# Altium schematic sheet payload_esp32.SchDoc (part 4 of 4)
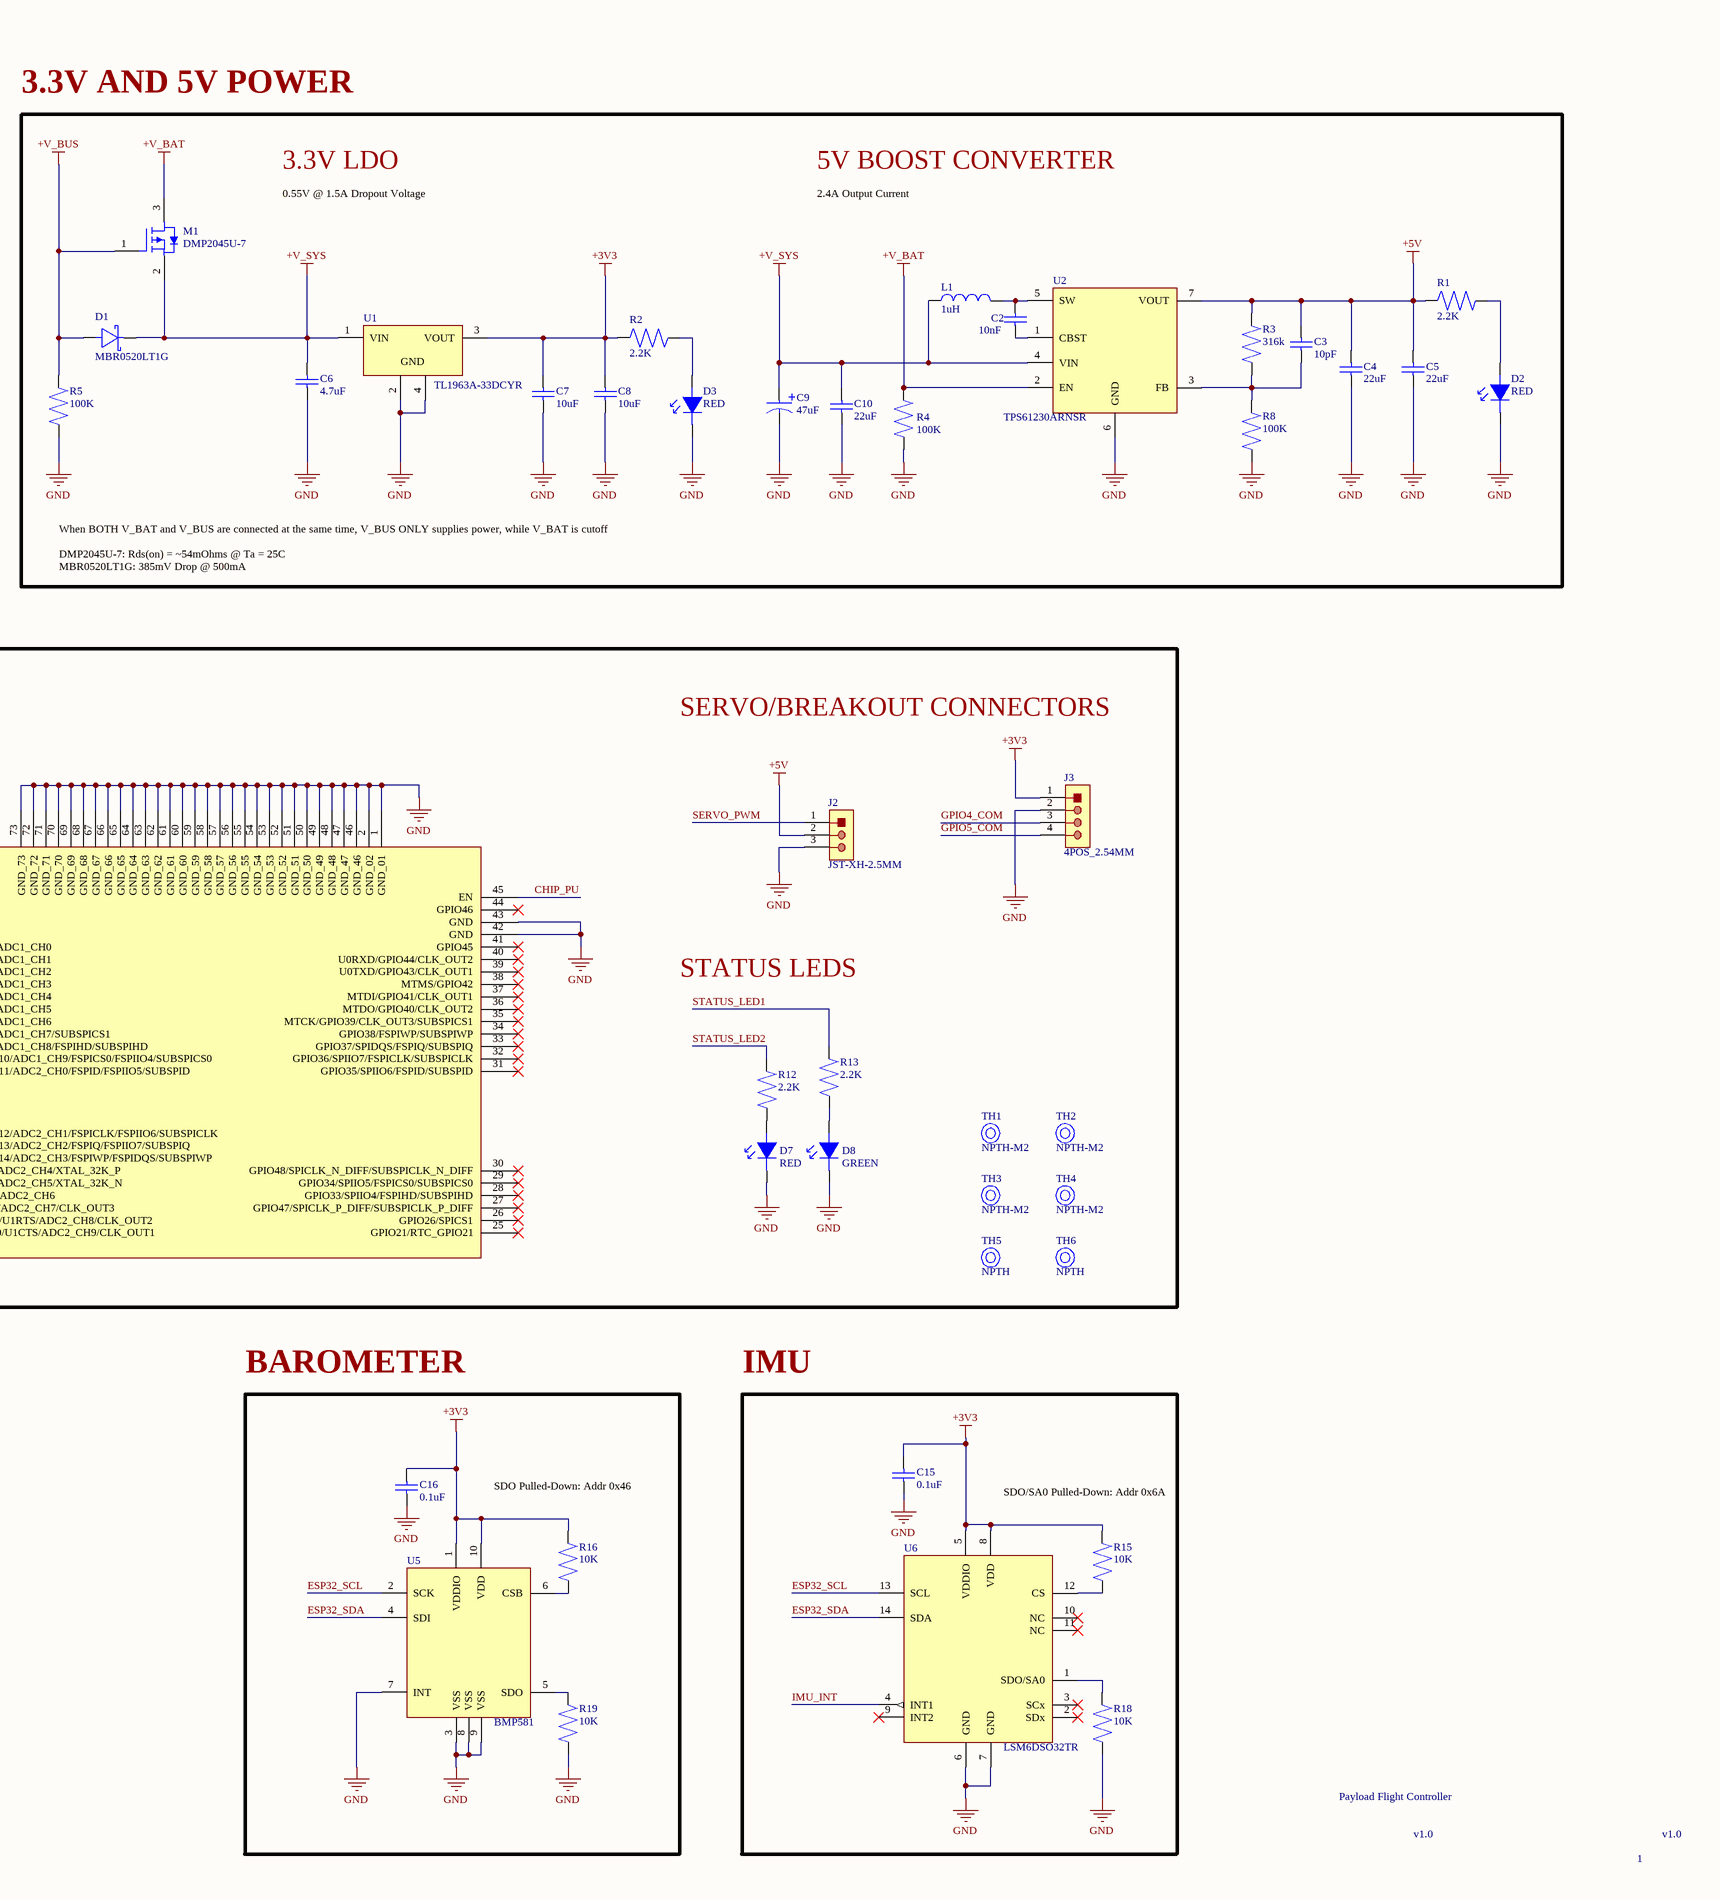
[diagram p4: payload_esp32.SchDoc, right]

## Library data of the parts (continued)
R14 = RC0402FR-07330RL: RES 330 OHM 1% 1/16W 0402; Manufacturer: Yageo Group; Max Power Dissipation: 63mW; Power Dissipation: 62.5mW; Value: 330Ω; Temperature Coefficient: 100ppm/°C; Voltage Rating: 50V; Supplier: DigiKey; Supplier Part Number: 311-330LRCT-ND; Manufacturer Part Number: RC0402FR-07330RL; RoHS: Compliant; Category: Chip SMD Resistors; Stock: 859594; Pricing: 1=0.1, 10=0.004, 25=0.0032, 10000=0.00127 (USD); Case/Package: 0402; Case Code (Imperial): 0402; China RoHS: Non-Compliant; Composition: Thick Film; Country of Origin: Mainland China, Taiwan; Depth: 500µm; Export Control Classification Number (ECCN) Code: EAR99; Features: Moisture Resistant; Height: 350µm; Harmonized Tariff Schedule (HTS) Code: 8533.21.00.30; Introduction Date: 2008-07-18; Lead Free: Lead Free; Length: 1mm; Lifecycle Status: Production; Max Operating Temperature: 155°C; Military Standard: Not; Min Operating Temperature: -55°C; Mounting Technology: Surface Mount; Pins: 2; Number of Terminals: 2; Number of Terminations: 2; Packaging: Tape & Reel; Power Rating: 63mW; REACH SVHC: Yes; Schedule B: 8533210045, 8533210045|8533210045|8533210045|8533210045|8533210045|8533210045|8533210045|8533210045|8533210045|8533210045|8533210045|8533210045|8533210045|8533210045|8533210045|8533210045|8533210045|8533210045|8533210045|8533210045|8533210045, 8533210045|8533210045|8533210045|8533210045|8533210045|8533210045|8533210045|8533210045|8533210045|8533210045|8533210045|8533210045|8533210045|8533210045|8533210045|8533210045|8533210045|8533210045|8533210045|8533210045|8533210045|8533210045, 8533210045|8533210045|8533210045|8533210045|8533210045|8533210045|8533210045|8533210045|8533210045|8533210045|8533210045|8533210045|8533210045|8533210045|8533210045|8533210045|8533210045|8533210045|8533210045|8533210045|8533210045|8533210045|8533210045; Termination: SMD/SMT; Tolerance: 1%; Voltage Rating (AC): 50V; Voltage Rating (DC): 50V; Width: 500µm; Working Voltage: 50V; ComponentLink1URL: https://datasheet.octopart.com:443/RC0402FR-07330RL-Yageo-datasheet-175887523.pdf?src-supplier=IHS; ComponentLink1Description: https://datasheet.octopart.com:443/RC0402FR-07330RL-Yageo-datasheet-175887523.pdf?src-supplier=IHS; ComponentLink2URL: https://datasheet.octopart.com:443/RC0402FR-07330RL-Yageo-datasheet-103092701.pdf?src-supplier=Upverter; ComponentLink2Description: https://datasheet.octopart.com:443/RC0402FR-07330RL-Yageo-datasheet-103092701.pdf?src-supplier=Upverter; ComponentLink3URL: https://datasheet.octopart.com:443/RC0402FR-07330RL-Yageo-datasheet-10408619.pdf?src-supplier=element14+APAC; ComponentLink3Description: https://datasheet.octopart.com:443/RC0402FR-07330RL-Yageo-datasheet-10408619.pdf?src-supplier=element14+APAC; ComponentLink4URL: https://datasheet.octopart.com:443/RC0402FR-07330RL-Yageo-datasheet-8324527.pdf?src-supplier=Newark; ComponentLink4Description: https://datasheet.octopart.com:443/RC0402FR-07330RL-Yageo-datasheet-8324527.pdf?src-supplier=Newark; ComponentLink5URL: https://datasheet.octopart.com:443/RC0402FR-07330RL-Yageo-datasheet-62067350.pdf?src-supplier=Farnell; ComponentLink5Description: https://datasheet.octopart.com:443/RC0402FR-07330RL-Yageo-datasheet-62067350.pdf?src-supplier=Farnell; ComponentLink6URL: https://datasheet.octopart.com:443/RC0402FR-07330RL-Yageo-Group-datasheet-176638170.pdf?src-supplier=Future+Electronics; ComponentLink6Description: https://datasheet.octopart.com:443/RC0402FR-07330RL-Yageo-Group-datasheet-176638170.pdf?src-supplier=Future+Electronics; ComponentLink7URL: https://datasheet.octopart.com:443/RC0402FR-07330RL-Yageo-datasheet-164759695.pdf?src-supplier=Future+Electronics; ComponentLink7Description: https://datasheet.octopart.com:443/RC0402FR-07330RL-Yageo-datasheet-164759695.pdf?src-supplier=Future+Electronics; ComponentLink8URL: https://datasheet.octopart.com:443/RC0402FR-07330RL-Yageo-datasheet-137700087.pdf?src-supplier=Future+Electronics; ComponentLink8Description: https://datasheet.octopart.com:443/RC0402FR-07330RL-Yageo-datasheet-137700087.pdf?src-supplier=Future+Electronics; ComponentLink9URL: https://datasheet.octopart.com:443/RC0402FR-07330RL-Yageo-datasheet-12531192.pdf?src-supplier=Future+Electronics; ComponentLink9Description: https://datasheet.octopart.com:443/RC0402FR-07330RL-Yageo-datasheet-12531192.pdf?src-supplier=Future+Electronics; ComponentLink10URL: https://datasheet.octopart.com:443/RC0402FR-07330RL-Yageo-datasheet-8324255.pdf?src-supplier=Future+Electronics; ComponentLink10Description: https://datasheet.octopart.com:443/RC0402FR-07330RL-Yageo-datasheet-8324255.pdf?src-supplier=Future+Electronics; ComponentLink11URL: https://datasheet.octopart.com:443/RC0402FR-07330RL-Yageo-datasheet-148775077.pdf?src-supplier=TME; ComponentLink11Description: https://datasheet.octopart.com:443/RC0402FR-07330RL-Yageo-datasheet-148775077.pdf?src-supplier=TME; ComponentLink12URL: https://datasheet.octopart.com:443/RC0402FR-07330RL-Yageo-datasheet-79472498.pdf?src-supplier=Megastar; ComponentLink12Description: https://datasheet.octopart.com:443/RC0402FR-07330RL-Yageo-datasheet-79472498.pdf?src-supplier=Megastar; ComponentLink13URL: https://datasheet.octopart.com/RC0402FR-07330RL-Yageo-datasheet-73766026.pdf; ComponentLink13Description: https://datasheet.octopart.com/RC0402FR-07330RL-Yageo-datasheet-73766026.pdf; ComponentLink14URL: https://datasheet.octopart.com:443/RC0402FR-07330RL-Yageo-datasheet-8329306.pdf?src-supplier=element14; ComponentLink14Description: https://datasheet.octopart.com:443/RC0402FR-07330RL-Yageo-datasheet-8329306.pdf?src-supplier=element14; ComponentLink15URL: http://sigma.octopart.com:80/conflict_mineral_statement/Yageo-company-3.pdf?src-supplier=Compliance+Statements; ComponentLink15Description: http://sigma.octopart.com:80/conflict_mineral_statement/Yageo-company-3.pdf?src-supplier=Compliance+Statements; ComponentLink16URL: http://sigma.octopart.com:80/rohs_statement/Yageo-company-2.pdf?src-supplier=Compliance+Statements; ComponentLink16Description: http://sigma.octopart.com:80/rohs_statement/Yageo-company-2.pdf?src-supplier=Compliance+Statements
R20 = WSLP1206R0120FEA: RES 0.012 OHM 1% 1W 1206; Manufacturer: Vishay; Value: 12mΩ; Temperature Coefficient: 75ppm/°C; Working Voltage: 109.5mV; Supplier: DigiKey; Supplier Part Number: 541-10353-1-ND; Manufacturer Part Number: WSLP1206R0120FEA; RoHS: Compliant; Category: Chip SMD Resistors; Stock: 7509; Pricing: 1=1.11, 10=0.723, 25=0.6188, 50=0.5532, 100=0.4976, 250=0.43656, 500=0.39838, 1000=0.36593 (USD); Case/Package: 1206; Case Code (Imperial): 1206; Case Code (Metric): 3216; China RoHS: Compliant; Composition: Metal Strip; Contact Plating: Tin; Country of Origin: Israel, Mexico, USA; Export Control Classification Number (ECCN) Code: EAR99; Height: 635µm; Harmonized Tariff Schedule (HTS) Code: 8533.21.00.30; Introduction Date: 2010-12-10; Length: 3.2mm; Lifecycle Status: Production; Max Operating Temperature: 170°C; Min Operating Temperature: -65°C; Mounting Technology: Surface Mount; Number of Terminals: 2; Power Dissipation: 1W; Power Rating: 1W; Radiation Hardening: No; Ratings: AEC-Q200; REACH SVHC: Yes; Termination: SMD/SMT; Tolerance: 1%; Weight: 16.187578mg; Width: 1.6mm; ComponentLink1URL: https://datasheet.octopart.com:443/WSLP1206R0120FEA-Vishay-datasheet-181963776.pdf?src-supplier=IHS; ComponentLink1Description: https://datasheet.octopart.com:443/WSLP1206R0120FEA-Vishay-datasheet-181963776.pdf?src-supplier=IHS; ComponentLink2URL: https://datasheet.octopart.com:443/WSLP1206R0120FEA-Vishay-datasheet-188933469.pdf?src-supplier=TME; ComponentLink2Description: https://datasheet.octopart.com:443/WSLP1206R0120FEA-Vishay-datasheet-188933469.pdf?src-supplier=TME; ComponentLink3URL: https://datasheet.octopart.com:443/WSLP1206R0120FEA-Vishay-datasheet-83134227.pdf?src-supplier=Future+Electronics; ComponentLink3Description: https://datasheet.octopart.com:443/WSLP1206R0120FEA-Vishay-datasheet-83134227.pdf?src-supplier=Future+Electronics; ComponentLink4URL: http://sigma.octopart.com:80/rohs_statement/Vishay-company-15.pdf?src-supplier=Compliance+Statements; ComponentLink4Description: http://sigma.octopart.com:80/rohs_statement/Vishay-company-15.pdf?src-supplier=Compliance+Statements
SW1 SW2 = PTS645SH50SMTR92LFS: SWITCH TACTILE SPST-NO 0.05A 12V; Manufacturer: ITT C&K; Manufacturer Series: PTS645; Actuator Type: Pushbutton; Contact Current(DC)-Max: 50mA; Contact DC Max Rating R Load: 0.05A@12VDC; Contact Resistance: 0.1mR; Dielectric Withstand Volts: 250VACV; Insulation Resistance: 100GR; PCB Hole Count: 4; Switch Action: MOMENTARY; Switch Function: SPST; Switch Type: Keypad; Body Breadth: 5.9944mm; Body Height: 3.4544mm; Supplier: Digikey; Supplier Part Number: CKN9085CT-ND; Manufacturer Part Number: PTS645SH50SMTR92LFS; RoHS: Yes; Category: Tactile Switches; Stock: 15461; Pricing: 1=0.33, 10=0.285, 25=0.2692, 100=0.2476, 250=0.23404, 500=0.22418 (USD); Mounting Technology: Surface Mount; Terminal Finish: Silver; Min Operating Temperature: -20°C; Max Operating Temperature: 60°C; JESD-609 Code: e4; Contact Voltage(DC)-Max: 12V; Termination: Solder; Body Length or Diameter: 5.9944mm; Terminal Length: 0.138inch; Reach SVHC Compliant: Yes; RoHS Compliant: Yes; ComponentLink1URL: https://datasheet.ciiva.com:443/pdfs/VipMasterIC/IC/CKCI/CKCI-S-A0001796527/CKCI-S-A0001796842-1.pdf?src-supplier=IHS+Markit; ComponentLink1Description: https://datasheet.ciiva.com:443/pdfs/VipMasterIC/IC/CKCI/CKCI-S-A0001796527/CKCI-S-A0001796842-1.pdf?src-supplier=IHS+Markit; ComponentLink2URL: https://datasheet.ciiva.com/29903/getdatasheetpartid-773702-29903807.pdf?src-supplier=Verical; ComponentLink2Description: https://datasheet.ciiva.com/29903/getdatasheetpartid-773702-29903807.pdf?src-supplier=Verical; ComponentLink3URL: https://datasheet.ciiva.com/22637/1707731-22637356.pdf?src-supplier=Element14; ComponentLink3Description: https://datasheet.ciiva.com/22637/1707731-22637356.pdf?src-supplier=Element14; ComponentLink4URL: https://datasheet.ciiva.com/14920/pts645-14920741.pdf?src-supplier=Digikey; ComponentLink4Description: https://datasheet.ciiva.com/14920/pts645-14920741.pdf?src-supplier=Digikey
TH1-TH4 = MHNPM2: MOUNTING HOLE NON-PLATATED 2MM
TH5 TH6 = NPTH_ASSEMBLY_TOOLING: TOOLING HOLE NON-PLATATED 1.152MM
U1 = TL1963A-33DCYR: IC REG LIN 3.3V 1.5A SOT-223-4; Manufacturer: Texas Instruments; Package Body Material: Plastic; Adjustability: FIXED; Dropout Voltage1-Max: 550mV; Dropout Voltage1-Nom: 340mV; Input Voltage Absolute-Max: 20V; Min Input Voltage: 3.8V; Channels: 1; Output Voltage1-Max: 3.4V; Output Voltage1-Min: 3.2V; Regulator Type: FIXED POSITIVE SINGLE OUTPUT LDO REGULATOR; Voltage Tolerance-Max: 3%; Qualification Status: Not Qualified; Supplier: Digikey; Supplier Part Number: 296-24897-1-ND; Manufacturer Part Number: TL1963A-33DCYR; RoHS: Yes; Category: Voltage Regulators - Linear; Stock: 4449; Pricing: 1=2.77, 10=2.069, 25=1.8936, 100=1.7, 250=1.60772, 500=1.55212, 1000=1.50634 (USD); Case/Package: SOP; Pins: 4; Package Shape: Rectangular; Terminal Finish: Tin; JESD-609 Code: e3; Max Supply Voltage: 20V; JESD-30 Code: R-PDSO-G4; Moisture Sensitivity Level: 2; Number of Outputs: 1; Operating Temperature, TJ-Max: 125°C; Operating Temperature, TJ-Min: -40°C; Output Current1-Max: 1.5A; Output Voltage1-Nom: 3.3V; Packaging: Tape and Reel; Peak Reflow Temperature (Cel): 260°C; Surface Mount: Yes; Technology: BIPOLAR; Terminal Form: Gull Wing; Terminal Position: DUAL; Length: 6.5mm; Width: 3.5mm; Height - Seated (Max): 1.8mm; Terminal Pitch: 2.3mm; Reach SVHC Compliant: Yes; RoHS Compliant: Yes; ComponentLink1URL: https://www.ti.com:443/lit/ds/symlink/tl1963a.pdf?src-supplier=IHS+Markit; ComponentLink1Description: https://www.ti.com:443/lit/ds/symlink/tl1963a.pdf?src-supplier=IHS+Markit; ComponentLink2URL: https://datasheet.ciiva.com/2046/-2046068.pdf?src-supplier=Digikey; ComponentLink2Description: https://datasheet.ciiva.com/2046/-2046068.pdf?src-supplier=Digikey
U2 = TPS61230ARNSR: IC REG BOOST ADJ 6A 7VQFN; Manufacturer: Texas Instruments; Manufacturer Lifecycle Status: ACTIVE; Max Duty Cycle: 90%; Max Junction Temperature (Tj): 125°C; Max Supply Voltage: 4.5V; Min Supply Voltage: 2.5V; Nominal Supply Current: 20µA; Number of Outputs: 1; Output Voltage: 5.5V; Quiescent Current: 25µA; Switching Frequency: 1.15MHz; Supplier: DigiKey; Supplier Part Number: 296-47375-1-ND; Manufacturer Part Number: TPS61230ARNSR; RoHS: Compliant; Category: Voltage Regulators - Switching; Stock: 2601; Pricing: 1=2.05, 10=1.516, 25=1.382, 100=1.2341, 250=1.16356, 500=1.12108, 1000=1.0861 (USD); Height: 1mm; Lead Free: Lead Free; Length: 2mm; Lifecycle Status: Production; Max Operating Temperature: 125°C; Min Operating Temperature: -40°C; Pins: 7; Output Current: 6A; Schedule B: 8542390000, 8542390000|8542390000|8542390000|8542390000|8542390000; Thickness: 900µm; Topology: Boost; Width: 2mm; ComponentLink1URL: https://octopart.com:443/opatz8j6/c1?t=dHE9Mj3rf7w62EXYgmq-jVIvTYRl-ezw8A6ZN8iFK-hU9IHvy4eeJYAVpiOhyFsOkRbsNoTbX31h1v3-RNY3Ll90e3lxbOXdPbJ34oz9H0cErFHhN33PjJLx3wJa2I_cxsLMuMp7ShDqxghqkzNMFD4o_o8ualCCpg4Ai5JBrv9BfV7-8HsNp_e_p_3E4kUicyxkwblKfjSolUgqG5BULSgXyjHeKQikKzLiusqAHChb1qOadz9Yi81pja8oiP1SfZqBKd6fCS7Rdyd-i7nMfCKK--pyBCwfI7CQy8eM2hAV1EaPkgY2OdIB8Si9Ja7sXdycIVcGGTZGAtM9bojrnTY3d_4a1ux1GyqAKCxbUCAi1vjAioVl5QqhDn8cRMNmvZ0Ru_dd&src-supplier=Texas+Instruments; ComponentLink1Description: https://octopart.com:443/opatz8j6/c1?t=dHE9Mj3rf7w62EXYgmq-jVIvTYRl-ezw8A6ZN8iFK-hU9IHvy4eeJYAVpiOhyFsOkRbsNoTbX31h1v3-RNY3Ll90e3lxbOXdPbJ34oz9H0cErFHhN33PjJLx3wJa2I_cxsLMuMp7ShDqxghqkzNMFD4o_o8ualCCpg4Ai5JBrv9BfV7-8HsNp_e_p_3E4kUicyxkwblKfjSolUgqG5BULSgXyjHeKQikKzLiusqAHChb1qOadz9Yi81pja8oiP1SfZqBKd6fCS7Rdyd-i7nMfCKK--pyBCwfI7CQy8eM2hAV1EaPkgY2OdIB8Si9Ja7sXdycIVcGGTZGAtM9bojrnTY3d_4a1ux1GyqAKCxbUCAi1vjAioVl5QqhDn8cRMNmvZ0Ru_dd&src-supplier=Texas+Instruments; ComponentLink2URL: https://datasheet.octopart.com:443/TPS61230ARNSR-Texas-Instruments-datasheet-147851292.pdf?src-supplier=Upverter; ComponentLink2Description: https://datasheet.octopart.com:443/TPS61230ARNSR-Texas-Instruments-datasheet-147851292.pdf?src-supplier=Upverter; ComponentLink3URL: https://datasheet.octopart.com:443/TPS61230ARNSR-Texas-Instruments-datasheet-159118192.pdf?src-supplier=LCSC; ComponentLink3Description: https://datasheet.octopart.com:443/TPS61230ARNSR-Texas-Instruments-datasheet-159118192.pdf?src-supplier=LCSC; ComponentLink4URL: https://datasheet.octopart.com:443/TPS61230ARNSR-Texas-Instruments-datasheet-140571919.pdf?src-supplier=Arrow.cn; ComponentLink4Description: https://datasheet.octopart.com:443/TPS61230ARNSR-Texas-Instruments-datasheet-140571919.pdf?src-supplier=Arrow.cn; ComponentLink5URL: http://sigma.octopart.com:80/reach_statement/Texas-Instruments-company-64.pdf?src-supplier=Compliance+Statements; ComponentLink5Description: http://sigma.octopart.com:80/reach_statement/Texas-Instruments-company-64.pdf?src-supplier=Compliance+Statements; ComponentLink6URL: http://sigma.octopart.com:80/conflict_mineral_statement/Texas-Instruments-company-63.pdf?src-supplier=Compliance+Statements; ComponentLink6Description: http://sigma.octopart.com:80/conflict_mineral_statement/Texas-Instruments-company-63.pdf?src-supplier=Compliance+Statements
U3 = ESP32-S3-MINI-1-N8: SMD module, ESP32-S3FN8, 8 MB SPI flash, PCB antenna; Manufacturer: Espressif Systems; Supplier: Digikey; Supplier Part Number: 1965-ESP32-S3-MINI-1-N8CT-ND; Manufacturer Part Number: ESP32-S3-MINI-1-N8; RoHS: No; Category: LDO; Stock: 3542; Pricing: 1=5.28, 10=4.566, 25=4.3196, 100=3.9802, 250=3.7768, 650=3.58103, 1300=3.44874, 1950=3.37497 (USD); ComponentLink1URL: https://datasheet.octopart.com/ESP32-S3-MINI-1-N8-Espressif-Systems-datasheet-165560562.pdf?src-supplier=TME; ComponentLink1Description: https://datasheet.octopart.com/ESP32-S3-MINI-1-N8-Espressif-Systems-datasheet-165560562.pdf?src-supplier=TME
U4 = BQ29700DSER: IC BATT PROT LI-ION 1CELL 6WSON; Manufacturer: Texas Instruments; Manufacturer Lifecycle Status: ACTIVE; Fault Protection: Over Current, Over/Under Voltage, Short Circuit; Number of Cells: 1; Operating Supply Voltage: 8V; Supplier: DigiKey; Supplier Part Number: 296-43985-1-ND; Manufacturer Part Number: BQ29700DSER; RoHS: Compliant; Category: Battery Management; Stock: 51822; Pricing: 1=0.51, 10=0.358, 25=0.32, 100=0.2783, 250=0.25836, 500=0.24632, 1000=0.2364 (USD); Contact Plating: Gold; Height: 800µm; Lead Free: Lead Free; Length: 1.5mm; Lifecycle Status: Production; Max Operating Temperature: 85°C; Min Operating Temperature: -40°C; Mounting Technology: Surface Mount; Pins: 6; Packaging: Tape & Reel (TR); Schedule B: 8542390000, 8542390000|8542390000|8542390000|8542390000|8542390000; Thickness: 750µm; Weight: 9.695537mg; Width: 1.5mm; ComponentLink1URL: https://sigma.octopart.com:443/176752815/technical_drawing/Texas-Instruments-BQ29700DSER.pdf?src-supplier=Texas+Instruments; ComponentLink1Description: https://sigma.octopart.com:443/176752815/technical_drawing/Texas-Instruments-BQ29700DSER.pdf?src-supplier=Texas+Instruments; ComponentLink2URL: https://octopart.com:443/opatz8j6/c1?t=BwF9udE7BqYWA4Q4ZfIk0Swe74ojxMwT3zzaXz4U9Z3dbPfG0XR5y9MHpcO1Dd770y6Y2bhYWjpfIiXRS_x2e43sJOs529DJby48b6rzQ0wslcAvv63DftC4-YcwV9_T_oPD9yrz2d3rqyjTQKet--nKJSysumdsi17kioLPLces7vmbkMT-12NDWDSUqcNFMdEzNl__8A7ybTFpcamJRrijxntTgw5Wwxp181bBhbSDGOaYCOWX2EV8GehXb2TlYnb1uaPe2n75iaAd5EhX5OP95W_eKEGloL793-cpUBrNab9nhKrPDMFkvN1TyIedQ4ppXbht4gsHtFCfCyAtXnKZciFqLEfzbeGS0ZafdaSOS9srZl2gYiark08OgJTdVlcYaA&src-supplier=Texas+Instruments; ComponentLink2Description: https://octopart.com:443/opatz8j6/c1?t=BwF9udE7BqYWA4Q4ZfIk0Swe74ojxMwT3zzaXz4U9Z3dbPfG0XR5y9MHpcO1Dd770y6Y2bhYWjpfIiXRS_x2e43sJOs529DJby48b6rzQ0wslcAvv63DftC4-YcwV9_T_oPD9yrz2d3rqyjTQKet--nKJSysumdsi17kioLPLces7vmbkMT-12NDWDSUqcNFMdEzNl__8A7ybTFpcamJRrijxntTgw5Wwxp181bBhbSDGOaYCOWX2EV8GehXb2TlYnb1uaPe2n75iaAd5EhX5OP95W_eKEGloL793-cpUBrNab9nhKrPDMFkvN1TyIedQ4ppXbht4gsHtFCfCyAtXnKZciFqLEfzbeGS0ZafdaSOS9srZl2gYiark08OgJTdVlcYaA&src-supplier=Texas+Instruments; ComponentLink3URL: https://datasheet.octopart.com:443/BQ29700DSER-Texas-Instruments-datasheet-59801669.pdf?src-supplier=Texas+Instruments; ComponentLink3Description: https://datasheet.octopart.com:443/BQ29700DSER-Texas-Instruments-datasheet-59801669.pdf?src-supplier=Texas+Instruments; ComponentLink4URL: https://datasheet.octopart.com:443/BQ29700DSER-Texas-Instruments-datasheet-37707165.pdf?src-supplier=Texas+Instruments; ComponentLink4Description: https://datasheet.octopart.com:443/BQ29700DSER-Texas-Instruments-datasheet-37707165.pdf?src-supplier=Texas+Instruments; ComponentLink5URL: https://datasheet.octopart.com:443/BQ29700DSER-Texas-Instruments-datasheet-24580485.pdf?src-supplier=Texas+Instruments; ComponentLink5Description: https://datasheet.octopart.com:443/BQ29700DSER-Texas-Instruments-datasheet-24580485.pdf?src-supplier=Texas+Instruments; ComponentLink6URL: https://sigma.octopart.com:443/49250835/technical_drawing/Texas-Instruments-BQ29700DSER.pdf?src-supplier=Texas+Instruments; ComponentLink6Description: https://sigma.octopart.com:443/49250835/technical_drawing/Texas-Instruments-BQ29700DSER.pdf?src-supplier=Texas+Instruments; ComponentLink7URL: https://datasheet.octopart.com:443/BQ29700DSER-Texas-Instruments-datasheet-159114692.pdf?src-supplier=LCSC; ComponentLink7Description: https://datasheet.octopart.com:443/BQ29700DSER-Texas-Instruments-datasheet-159114692.pdf?src-supplier=LCSC; ComponentLink8URL: https://datasheet.octopart.com:443/BQ29700DSER-Texas-Instruments-datasheet-164413061.pdf?src-supplier=SHENGYU+ELECTRONICS; ComponentLink8Description: https://datasheet.octopart.com:443/BQ29700DSER-Texas-Instruments-datasheet-164413061.pdf?src-supplier=SHENGYU+ELECTRONICS; ComponentLink9URL: http://sigma.octopart.com:80/reach_statement/Texas-Instruments-company-64.pdf?src-supplier=Compliance+Statements; ComponentLink9Description: http://sigma.octopart.com:80/reach_statement/Texas-Instruments-company-64.pdf?src-supplier=Compliance+Statements; ComponentLink10URL: http://sigma.octopart.com:80/conflict_mineral_statement/Texas-Instruments-company-63.pdf?src-supplier=Compliance+Statements; ComponentLink10Description: http://sigma.octopart.com:80/conflict_mineral_statement/Texas-Instruments-company-63.pdf?src-supplier=Compliance+Statements
U5 = BMP581: SENSOR 125kPa Barometric 10-Pin LGA; Manufacturer: Bosch Tools; Accuracy: 10%; Current Rating: 1.3µA; Max Supply Voltage: 3.6V; Min Supply Voltage: 1.65V; Number of Bits: 24; Supplier: DigiKey; Supplier Part Number: 828-BMP581CT-ND; Manufacturer Part Number: BMP581; RoHS: Compliant; Category: Pressure Sensors; Stock: 26969; Pricing: 1=2.92, 5=2.606, 10=2.489, 25=2.3488, 50=2.2534, 100=2.1659, 500=1.98984, 1000=1.92429, 5000=1.9125, 10000=1.74303 (USD); Height: 800µm; Introduction Date: 2022-04-08; Length: 2mm; Lifecycle Status: Production; Max Operating Temperature: 85°C; Min Operating Temperature: -40°C; Mounting Technology: Surface Mount; REACH SVHC: Yes; ComponentLink1URL: https://datasheet.octopart.com:443/BMP581-Bosch-Tools-datasheet-181206546.pdf?src-supplier=IHS; ComponentLink1Description: https://datasheet.octopart.com:443/BMP581-Bosch-Tools-datasheet-181206546.pdf?src-supplier=IHS
U6 = LSM6DSO32TR: SENSOR IMU 14-PIN LGA T/R; Manufacturer: STMicroelectronics; Body Material: Plastic; Max Supply Voltage: 3.6V; Min Supply Voltage: 1.71V; Operating Supply Current: 550µA; Operating Supply Voltage: 1.8V; Output Configuration: Digital; Supplier: DigiKey; Supplier Part Number: 497-LSM6DSO32CT-ND; Manufacturer Part Number: LSM6DSO32TR; RoHS: Compliant; Category: Inertial Measurement Units (IMUs); Stock: 1490; Pricing: 1=3.5, 5=3.124, 10=2.987, 25=2.8224, 50=2.7102, 100=2.6073, 500=2.4003, 1000=2.34502 (USD); China RoHS: Compliant; Country of Origin: Philippines; Export Control Classification Number (ECCN) Code: EAR99; Height: 860µm; Introduction Date: 2020-03-16; Length: 3mm; Lifecycle Status: Production; Max Operating Temperature: 85°C; Min Operating Temperature: -40°C; Mounting Technology: Surface Mount; Number of Terminals: 14; Output Type: Digital; REACH SVHC: Yes; ComponentLink1URL: https://datasheet.octopart.com:443/LSM6DSO32TR-STMicroelectronics-datasheet-152560011.pdf?src-supplier=Upverter; ComponentLink1Description: https://datasheet.octopart.com:443/LSM6DSO32TR-STMicroelectronics-datasheet-152560011.pdf?src-supplier=Upverter